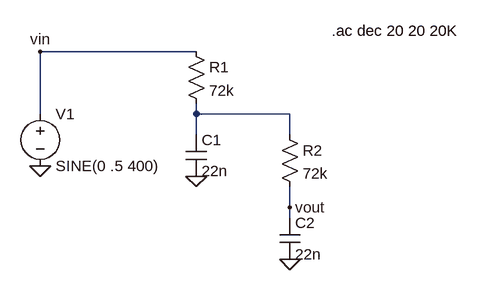
[diagram p0: schematic Draft1.asc]
Draft1.asc, the LTspice schematic file:
Version 4
SHEET 1 880 680
WIRE 16 128 -224 128
WIRE -224 224 -224 128
WIRE 16 224 16 208
WIRE 160 224 16 224
WIRE 16 256 16 224
WIRE 160 256 160 224
WIRE 160 368 160 336
WIRE 160 384 160 368
FLAG 160 448 0
FLAG 16 320 0
FLAG -224 304 0
FLAG 160 368 vout
FLAG -224 128 vin
SYMBOL voltage -224 208 R0
SYMATTR InstName V1
SYMATTR Value SINE(0 .5 400)
SYMATTR Value2 AC .5
SYMBOL res 0 112 R0
SYMATTR InstName R1
SYMATTR Value 72k
SYMBOL res 144 240 R0
SYMATTR InstName R2
SYMATTR Value 72k
SYMBOL cap 0 256 R0
SYMATTR InstName C1
SYMATTR Value 22n
SYMBOL cap 144 384 R0
SYMATTR InstName C2
SYMATTR Value 22n
TEXT 224 96 Left 2 !.ac dec 20 20 20K

The netlist it stands for:
* Draft1.asc
V1 vin 0 SINE(0 .5 400) AC .5
R1 vin N001 72k
R2 N001 vout 72k
C1 N001 0 22n
C2 vout 0 22n
.ac dec 20 20 20K
.backanno
.end